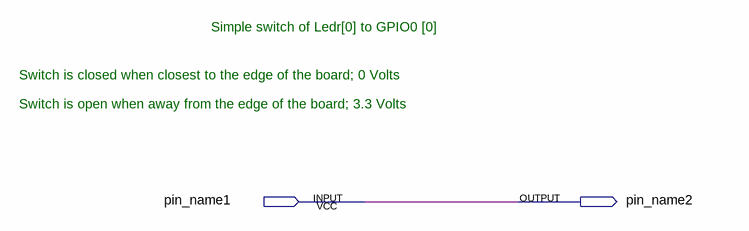
[diagram p0: schematic sheet]
// Quartus schematic SwitchGPIO.bdf as structural Verilog: 0 symbols, 2 pins
module SwitchGPIO (
  input  pin_name1,
  output pin_name2
);


  assign pin_name2 = pin_name1;

  // Notes on the sheet:
  //   Simple switch of Ledr[0] to GPIO0 [0]
  //   Switch is closed when closest to the edge of the board; 0 Volts 
  //   Switch is open when away from the edge of the board; 3.3 Volts
endmodule
